# EAGLE design Airquality (EAGLE 9.6.2)
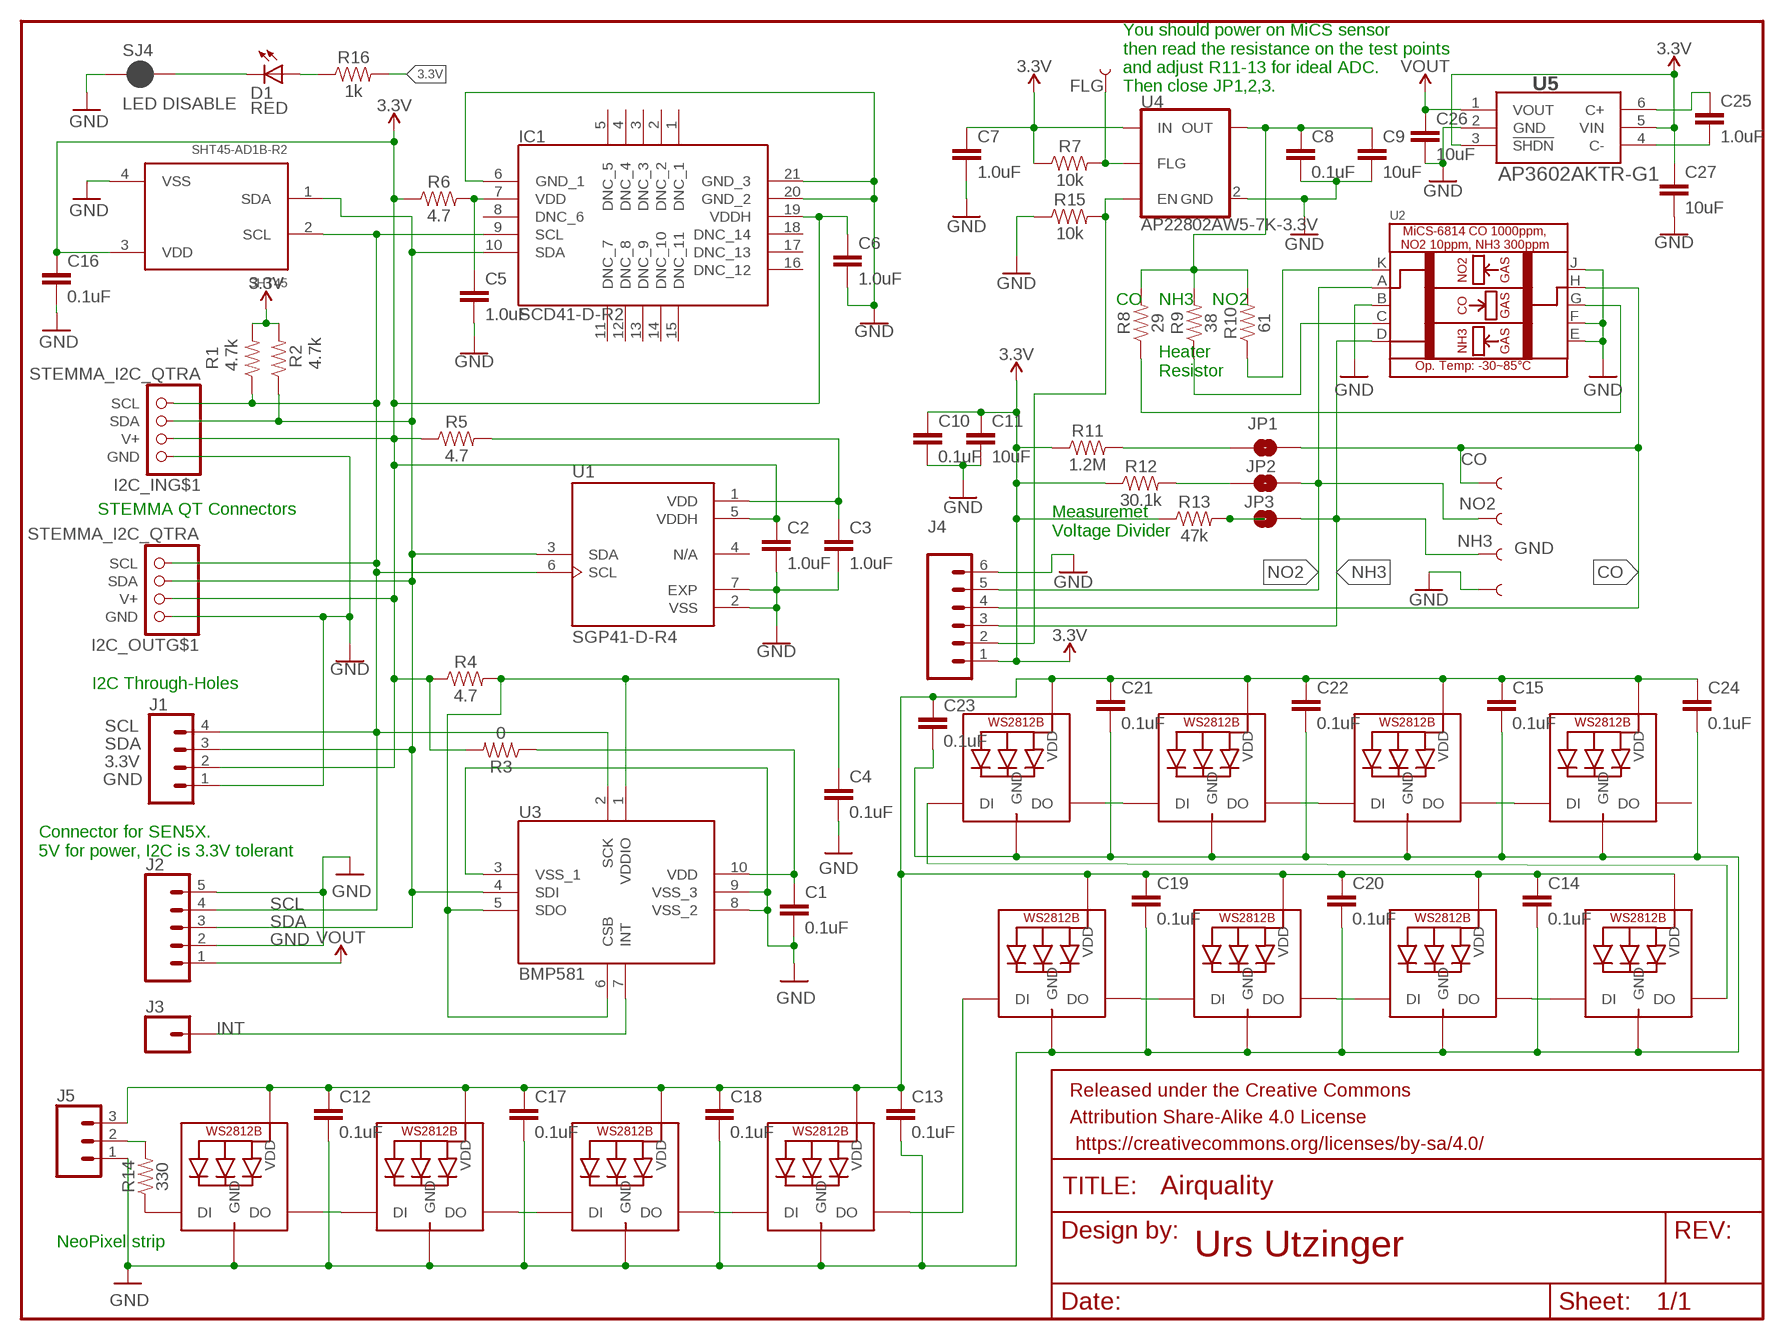
[diagram p0: schematic, sheet 1]

## Parts
C1  0.1uF  0.1UF-0603-25V-(+80/-20%)  [0603]
C2  1.0uF  1.0UF-0603-16V-10%  [0603]
C3  1.0uF  1.0UF-0603-16V-10%  [0603]
C4  0.1uF  0.1UF-0603-25V-(+80/-20%)  [0603]
C5  1.0uF  1.0UF-0603-16V-10%  [0603]
C6  1.0uF  1.0UF-0603-16V-10%  [0603]
C7  1.0uF  1.0UF-0603-16V-10%  [0603]
C8  0.1uF  0.1UF-0603-25V-(+80/-20%)  [0603]
C9  10uF  10UF-0603-6.3V-20%  [0603]
C10  0.1uF  0.1UF-0603-25V-(+80/-20%)  [0603]
C11  10uF  10UF-0603-6.3V-20%  [0603]
C12  0.1uF  0.1UF-0402-16V-10%  [0402]
C13  0.1uF  0.1UF-0402-16V-10%  [0402]
C14  0.1uF  0.1UF-0402-16V-10%  [0402]
C15  0.1uF  0.1UF-0402-16V-10%  [0402]
C16  0.1uF  0.1UF-0603-25V-(+80/-20%)  [0603]
C17  0.1uF  0.1UF-0402-16V-10%  [0402]
C18  0.1uF  0.1UF-0402-16V-10%  [0402]
C19  0.1uF  0.1UF-0402-16V-10%  [0402]
C20  0.1uF  0.1UF-0402-16V-10%  [0402]
C21  0.1uF  0.1UF-0402-16V-10%  [0402]
C22  0.1uF  0.1UF-0402-16V-10%  [0402]
C23  0.1uF  0.1UF-0402-16V-10%  [0402]
C24  0.1uF  0.1UF-0402-16V-10%  [0402]
C25  1.0uF  1.0UF-0402-16V-10%  [0402]
C26  10uF  10UF-0603-6.3V-20%  [0603]
C27  10uF  10UF-0603-6.3V-20%  [0603]
CO  TEST-POINT3X4  [PAD.03X.04]
D1  RED  LED-RED0603  [LED-0603]
FLG  TEST-POINT3X4  [PAD.03X.04]
FRAME1  FRAME-LETTERNO_PACKAGE  [DUMMY]
GND  TEST-POINT3X4  [PAD.03X.04]
I2C_IN  STEMMA_I2C_QTRA  [JST_SH4_RA]
I2C_OUT  STEMMA_I2C_QTRA  [JST_SH4_RA]
IC1  SCD41-D-R2  [SCD41DR2]
J1  CONN_04  [1X04]
J2  CONN_05  [1X05]
J3  CONN_01  [1X01]
J4  CONN_06SILK_FEMALE_PTH  [1X06]
J5  CONN_03  [1X03]
JP1  JUMPER-SMT_2_NO_SILK  [SMT-JUMPER_2_NO_SILK]
JP2  JUMPER-SMT_2_NO_SILK  [SMT-JUMPER_2_NO_SILK]
JP3  JUMPER-SMT_2_NO_SILK  [SMT-JUMPER_2_NO_SILK]
LED0  WS2812B_2020  [WS2812B_2020]
LED1  WS2812B_2020  [WS2812B_2020]
LED2  WS2812B_2020  [WS2812B_2020]
LED3  WS2812B_2020  [WS2812B_2020]
LED4  WS2812B_2020  [WS2812B_2020]
LED5  WS2812B_2020  [WS2812B_2020]
LED6  WS2812B_2020  [WS2812B_2020]
LED7  WS2812B_2020  [WS2812B_2020]
LED8  WS2812B_2020  [WS2812B_2020]
LED9  WS2812B_2020  [WS2812B_2020]
LED10  WS2812B_2020  [WS2812B_2020]
LED11  WS2812B_2020  [WS2812B_2020]
NH3  TEST-POINT3X4  [PAD.03X.04]
NO2  TEST-POINT3X4  [PAD.03X.04]
R1  4.7k  4.7KOHM-0603-1/10W-1%  [0603]
R2  4.7k  4.7KOHM-0603-1/10W-1%  [0603]
R3  0  10OHM-0603-1/10W-5%  [0603]
R4  4.7  10OHM-0603-1/10W-5%  [0603]
R5  4.7  10OHM-0603-1/10W-1%  [0603]
R6  4.7  10OHM-0603-1/10W-1%  [0603]
R7  10k  10KOHM-0603-1/10W-1%  [0603]
R8  29  27OHM-0603-1/10W-1%  [0603]
R9  38  33OHM-0603-1/10W-1%  [0603]
R10  61  82OHM-0603-1/10W-1%  [0603]
R11  1.2M  1.2MOHM-0603-1/10W-1%  [0603]
R12  30.1k  30.1KOHM-0603-1/10W-1%  [0603]
R13  47k  47KOHM-0603-1/10W-1%  [0603]
R14  330  330OHM-0603-1/10W-1%  [0603]
R15  10k  10KOHM-0603-1/10W-1%  [0603]
R16  1k  1KOHM-0603-1/10W-1%  [0603]
SHT45  SHT45-AD1B-R2  [SHT4X]
SJ4  LED DISABLE  JUMPER-SMT_2_NC_PASTE_SILK  [SMT-JUMPER_2_NC_PASTE_SILK]
U1  SGP41-D-R4  [XDCR_SGP41-D-R4]
U2  MICROBUILDER_MICS-5524  [MICROBUILDER_MICS-5524]
U3  BMP581  [BMP581]
U4  AP22802AW5-7K-3.3V  [SOT25]
U5  AP3602AKTR-G1  [SOT95P280X125-6N]

## Nets
3.3V: C2.1 C6.1 C7.1 C10.1 C11.1 C16.1 C27.1 I2C_IN.2(V+) I2C_OUT.2(V+) IC1.19(VDDH) J1.2 J4.1 R1.2 R2.2 R3.2 R4.1 R5.1 R6.1 R7.1 R11.1 R12.1 R13.1 R16.2 SHT45.3(VDD) U1.5(VDDH) U4.5(IN) U5.3(!SHDN) U5.5(VIN)
CO: CO.P$1 J4.4 JP1.2 U2.H
GND: C1.2 C2.2 C3.2 C4.2 C5.2 C6.2 C7.2 C8.2 C9.2 C10.2 C11.2 C12.2 C13.2 C14.2 C15.2 C16.2 C17.2 C18.2 C19.2 C20.2 C21.2 C22.2 C23.2 C24.2 C26.2 C27.2 GND.P$1 I2C_IN.1(GND) I2C_OUT.1(GND) IC1.6(GND_1) IC1.20(GND_2) IC1.21(GND_3) J1.1 J2.2 J2.5 J4.6 J5.1 LED0.2(GND) LED1.2(GND) LED2.2(GND) LED3.2(GND) LED4.2(GND) LED5.2(GND) LED6.2(GND) LED7.2(GND) LED8.2(GND) LED9.2(GND) LED10.2(GND) LED11.2(GND) R15.1 SHT45.4(VSS) SJ4.1 U1.2(VSS) U1.7(EXP) U2.B U2.E U2.F U2.J U3.3(VSS_1) U3.8(VSS_2) U3.9(VSS_3) U4.2(GND) U5.2(GND)
INT: J3.1 U3.7(INT)
N$1: C4.1 R4.2 U3.1(VDDIO) U3.5(SDO) U3.6(CSB)
N$2: C1.1 R3.1 U3.10(VDD)
N$3: FLG.P$1 R7.2 U4.3(FLG)
N$4: C3.1 R5.2 U1.1(VDD)
N$5: C5.1 IC1.7(VDD) R6.2
N$6: LED0.1(DO) LED1.3(DI)
N$7: C8.1 C9.1 R8.2 R9.2 R10.2 U4.1(OUT)
N$8: R10.1 U2.K
N$10: JP1.1 R11.2
N$11: R9.1 U2.C
N$12: JP2.1 R12.2
N$13: R8.1 U2.G
N$14: JP3.1 R13.2
N$15: C25.1 U5.6(C+)
N$16: LED1.1(DO) LED2.3(DI)
N$17: LED2.1(DO) LED3.3(DI)
N$18: LED4.1(DO) LED5.3(DI)
N$19: LED5.1(DO) LED6.3(DI)
N$20: LED6.1(DO) LED7.3(DI)
N$21: LED3.1(DO) LED4.3(DI)
N$22: J5.2 R14.2
N$23: LED0.3(DI) R14.1
N$24: LED7.1(DO) LED8.3(DI)
N$25: LED10.1(DO) LED11.3(DI)
N$26: D1.A R16.1
N$27: LED9.1(DO) LED10.3(DI)
N$28: D1.C SJ4.2
N$29: LED8.1(DO) LED9.3(DI)
N$30: C25.2 U5.4(C-)
N$31: C12.1 C13.1 C14.1 C15.1 C17.1 C18.1 C19.1 C20.1 C21.1 C22.1 C23.1 C24.1 J5.3 LED0.4(VDD) LED1.4(VDD) LED2.4(VDD) LED3.4(VDD) LED4.4(VDD) LED5.4(VDD) LED6.4(VDD) LED7.4(VDD) LED8.4(VDD) LED9.4(VDD) LED10.4(VDD) LED11.4(VDD)
N$32: J4.2 R15.2 U4.4(EN)
NH3: J4.3 JP3.2 NH3.P$1 U2.D
NO2: J4.5 JP2.2 NO2.P$1 U2.A
SCL: I2C_IN.4(SCL) I2C_OUT.4(SCL) IC1.9(SCL) J1.4 J2.4 R1.1 SHT45.2(SCL) U1.6(SCL) U3.2(SCK)
SDA: I2C_IN.3(SDA) I2C_OUT.3(SDA) IC1.10(SDA) J1.3 J2.3 R2.1 SHT45.1(SDA) U1.3(SDA) U3.4(SDI)
VOUT: C26.1 J2.1 U5.1(VOUT)
Unconnected: I2C_IN.MT1(MT) I2C_IN.MT2(MT) I2C_OUT.MT1(MT) I2C_OUT.MT2(MT) IC1.1(DNC_1) IC1.2(DNC_2) IC1.3(DNC_3) IC1.4(DNC_4) IC1.5(DNC_5) IC1.8(DNC_6) IC1.11(DNC_7) IC1.12(DNC_8) IC1.13(DNC_9) IC1.14(DNC_10) IC1.15(DNC_11) IC1.16(DNC_12) IC1.17(DNC_13) IC1.18(DNC_14) LED11.1(DO) U1.4(N/A)

## Notes on the sheet
- You should power on MiCS sensor
  then read the resistance on the test points
  and adjust R11-13 for ideal ADC.
  Then close JP1,2,3.
- CO | NH3 | NO2
- Heater
  Resistor
- STEMMA QT Connectors
- Measuremet
  Voltage Divider
- I2C Through-Holes
- Connector for SEN5X.
  5V for power, I2C is 3.3V tolerant
- NeoPixel strip
- Urs Utzinger

## Library data of the parts
C1 C4 C8 C10 C16 = SparkFun-Capacitors:0.1UF: 0.1µF ceramic capacitors A capacitor is a passive two-terminal electrical component used to store electrical energy temporarily in an electric field.; PROD_ID: CAP-00810
C2 C3 C5-C7 = SparkFun-Capacitors:1.0UF: 1µF ceramic capacitors A capacitor is a passive two-terminal electrical component used to store electrical energy temporarily in an electric field.; PROD_ID: CAP-00868
C9 C11 C26 C27 = SparkFun-Capacitors:10UF: 10.0µF ceramic capacitors A capacitor is a passive two-terminal electrical component used to store electrical energy temporarily in an electric field.; PROD_ID: CAP-11015
C12-C15 C17-C24 = SparkFun-Capacitors:0.1UF: 0.1µF ceramic capacitors A capacitor is a passive two-terminal electrical component used to store electrical energy temporarily in an electric field.; PROD_ID: CAP-12416
C25 = SparkFun-Capacitors:1.0UF: 1µF ceramic capacitors A capacitor is a passive two-terminal electrical component used to store electrical energy temporarily in an electric field.; PROD_ID: CAP-12417
CO FLG GND NH3 NO2 = SparkFun-Connectors:TEST-POINT: SparkFun Test Points Bare copper test points for troubleshooting or In-Circuit-Testing. These are used by our Production team for verifying production board runs using pogo-pins on test beds. SparkFun Products: SparkFun LSM9DS1 Breakout <https://www.sparkfun.com/products/13284> SparkFun PSOC <https://www.sparkfun.com/products/13714> SparkFun Load Cell Amplifier <https://www.sparkfun.com/products/13879>
D1 = SparkFun-LED:LED-RED: Assorted Red LEDs LilyPad 1206- DIO-09912 1206- DIO-00809 0603- DIO-00819; PROD_ID: DIO-00819
FRAME1 = SparkFun-Aesthetics:FRAME-LETTER: Schematic Frame - Letter Standard 8.5x11 US Letter frame; DESIGNER: Nobody; VERSION: v01
I2C_IN I2C_OUT = adafruit_electromech:STEMMA_I2C; LCSC: C145961
IC1 = SCD41-D-R2:SCD41-D-R2: Air Quality Sensor CO2 Sensor 2.5V/3.3V/5V 20-Pin SMD EP Source: Datasheet <https://cz.mouser.com/datasheet/2/682/Sensirion_CO2_Sensors_SCD4x_Datasheet-2010009.pdf>; ARROW_PART_NUMBER: SCD41-D-R2; ARROW_PRICE-STOCK: https://www.arrow.com/en/products/scd41-d-r2/sensirion-ag?region=asia; DESCRIPTION: Air Quality Sensor CO2 Sensor 2.5V/3.3V/5V 20-Pin SMD EP; HEIGHT: 6.8mm; MANUFACTURER_NAME: Sensirion; MANUFACTURER_PART_NUMBER: SCD41-D-R2; MOUSER_PART_NUMBER: 403-SCD41-D-R2; MOUSER_PRICE-STOCK: https://www.mouser.co.uk/ProductDetail/Sensirion/SCD41-D-R2?qs=HBWAp0VN4Ri4o7ei4T3s0g%3D%3D
J1 = SparkFun-Connectors:CONN_04: Multi connection point. Often used as Generic Header-pin footprint for 0.1 inch spaced/style header connections On any of the 0.1 inch spaced packages, you can populate with these: Break Away Headers - Straight <https://www.sparkfun.com/products/116> (PRT-00116) Break Away Male Headers - Right Angle <https://www.sparkfun.com/products/553> (PRT-00553) Female Headers <https://www.sparkfun.com/products/115> (PRT-00115) Break Away Headers - Machine Pin <https://www.sparkfun.com/products/117> (PRT-00117) Break Away Female Headers - Swiss Machine Pin <https://www.sparkfun.com/products/743> (PRT-00743) For SCREWTERMINALS and SPRING TERMINALS visit here: Screw Terimnals on SparkFun.com <https://www.sparkfun.com/search/results?term=Screw+Terminals> (5mm/3.5mm/2.54mm spacing) This device is also useful as a general connection point to wire up your design to another part of your project. Our various solder wires solder well into these plated through hole pads. Hook-Up Wire - Assortment (Stranded, 22 AWG) <https://www.sparkfun.com/products/11375> (PRT-11375) Hook-Up Wire - Assortment (Solid Core, 22 AWG) <https://www.sparkfun.com/products/11367> (PRT-11367) View the entire wire category on our website here <https://www.sparkfun.com/categories/141> Special notes: Molex polarized connector foot print use with SKU : PRT-08231 with associated crimp pins and housings. 1MM SMD Version SKU: PRT-10208; PROD_ID: CONN-09696
J2 = SparkFun-Connectors:CONN_05: Multi connection point. Often used as Generic Header-pin footprint for 0.1 inch spaced/style header connections On any of the 0.1 inch spaced packages, you can populate with these: Break Away Headers - Straight <https://www.sparkfun.com/products/116> (PRT-00116) Break Away Male Headers - Right Angle <https://www.sparkfun.com/products/553> (PRT-00553) Female Headers <https://www.sparkfun.com/products/115> (PRT-00115) Break Away Headers - Machine Pin <https://www.sparkfun.com/products/117> (PRT-00117) Break Away Female Headers - Swiss Machine Pin <https://www.sparkfun.com/products/743> (PRT-00743) For SCREWTERMINALS and SPRING TERMINALS visit here: Screw Terimnals on SparkFun.com <https://www.sparkfun.com/search/results?term=Screw+Terminals> (5mm/3.5mm/2.54mm spacing) This device is also useful as a general connection point to wire up your design to another part of your project. Our various solder wires solder well into these plated through hole pads. Hook-Up Wire - Assortment (Stranded, 22 AWG) <https://www.sparkfun.com/products/11375> (PRT-11375) Hook-Up Wire - Assortment (Solid Core, 22 AWG) <https://www.sparkfun.com/products/11367> (PRT-11367) View the entire wire category on our website here <https://www.sparkfun.com/categories/141> Special notes: Molex polarized connector foot print use with SKU : PRT-08231 with associated crimp pins and housings. 1MM SMD Version SKU: PRT-10208
J3 = SparkFun-Connectors:CONN_01: Single connection point. Often used as Generic Header-pin footprint for 0.1 inch spaced/style header connections On any of the 0.1 inch spaced packages, you can populate with these: Break Away Headers - Straight <https://www.sparkfun.com/products/116> (PRT-00116) Break Away Male Headers - Right Angle <https://www.sparkfun.com/products/553> (PRT-00553) Female Headers <https://www.sparkfun.com/products/115> (PRT-00115) Break Away Headers - Machine Pin <https://www.sparkfun.com/products/117> (PRT-00117) Break Away Female Headers - Swiss Machine Pin <https://www.sparkfun.com/products/743> (PRT-00743) This device is also useful as a general connection point to wire up your design to another part of your project. Our various solder wires solder well into these plated through hole pads. Hook-Up Wire - Assortment (Stranded, 22 AWG) <https://www.sparkfun.com/products/11375> (PRT-11375) Hook-Up Wire - Assortment (Solid Core, 22 AWG) <https://www.sparkfun.com/products/11367> (PRT-11367) View the entire wire category on our website here <https://www.sparkfun.com/categories/141> Special notes: SMTSO-256-ET is a "flush mount" nut for a 4-40 screw. We mostly use this on specialty testbeds; it is a nice way to connect hardware to your PCB at an adjustable hieght. Also note, the SNAP packages are for using a snappable style connector. We sell a baggie of snaps and they are also used on two LilyPad designs: Snap Assortment - 30 pack (male and female) <https://www.sparkfun.com/products/11347> (DEV-11347) LilyPad Arduino SimpleSnap <https://www.sparkfun.com/products/10941> (DEV-10941) LilyPad SimpleSnap Protoboard <https://www.sparkfun.com/products/10940> (DEV-10940)
J4 = SparkFun-Connectors:CONN_06: Multi connection point. Often used as Generic Header-pin footprint for 0.1 inch spaced/style header connections On any of the 0.1 inch spaced packages, you can populate with these: Break Away Headers - Straight <https://www.sparkfun.com/products/116> (PRT-00116) Break Away Male Headers - Right Angle <https://www.sparkfun.com/products/553> (PRT-00553) Female Headers <https://www.sparkfun.com/products/115> (PRT-00115) Break Away Headers - Machine Pin <https://www.sparkfun.com/products/117> (PRT-00117) Break Away Female Headers - Swiss Machine Pin <https://www.sparkfun.com/products/743> (PRT-00743) Arduino Stackable Header - 6 Pin <https://www.sparkfun.com/products/9280> (PRT-09280) For SCREWTERMINALS and SPRING TERMINALS visit here: Screw Terimnals on SparkFun.com <https://www.sparkfun.com/search/results?term=Screw+Terminals> (5mm/3.5mm/2.54mm spacing) This device is also useful as a general connection point to wire up your design to another part of your project. Our various solder wires solder well into these plated through hole pads. Hook-Up Wire - Assortment (Stranded, 22 AWG) <https://www.sparkfun.com/products/11375> (PRT-11375) Hook-Up Wire - Assortment (Solid Core, 22 AWG) <https://www.sparkfun.com/products/11367> (PRT-11367) View the entire wire category on our website here <https://www.sparkfun.com/categories/141>; PROD_ID: CONN-08437
J5 = SparkFun-Connectors:CONN_03: Multi connection point. Often used as Generic Header-pin footprint for 0.1 inch spaced/style header connections On any of the 0.1 inch spaced packages, you can populate with these: Break Away Headers - Straight <https://www.sparkfun.com/products/116> (PRT-00116) Break Away Male Headers - Right Angle <https://www.sparkfun.com/products/553> (PRT-00553) Female Headers <https://www.sparkfun.com/products/115> (PRT-00115) Break Away Headers - Machine Pin <https://www.sparkfun.com/products/117> (PRT-00117) Break Away Female Headers - Swiss Machine Pin <https://www.sparkfun.com/products/743> (PRT-00743) Stackable Header - 3 Pin (Female, 0.1") <https://www.sparkfun.com/products/13875> (PRT-13875) For SCREWTERMINALS and SPRING TERMINALS visit here: Screw Terimnals on SparkFun.com <https://www.sparkfun.com/search/results?term=Screw+Terminals> (5mm/3.5mm/2.54mm spacing) This device is also useful as a general connection point to wire up your design to another part of your project. Our various solder wires solder well into these plated through hole pads. Hook-Up Wire - Assortment (Stranded, 22 AWG) <https://www.sparkfun.com/products/11375> (PRT-11375) Hook-Up Wire - Assortment (Solid Core, 22 AWG) <https://www.sparkfun.com/products/11367> (PRT-11367) View the entire wire category on our website here <https://www.sparkfun.com/categories/141> Special notes: Molex polarized connector foot print use with SKU : PRT-08232 with associated crimp pins and housings.
JP1-JP3 = SparkFun-Jumpers:JUMPER-SMT_2_NO: Normally open jumper This jumper has two pads in close proximity to each other. Apply solder to close the connection. Round pads are easier to solder for beginners, but are a lot larger. SparkFun Product that uses the round pads: SparkFun EL Sequencer <https://www.sparkfun.com/products/12781>
LED0 LED1-LED11 = NEOPixel:WS2812B
R1 R2 = SparkFun-Resistors:4.7KOHM: 4.7kΩ resistor A resistor is a passive two-terminal electrical component that implements electrical resistance as a circuit element. Resistors act to reduce current flow, and, at the same time, act to lower voltage levels within circuits. - Wikipedia; PROD_ID: RES-07857
R3 R4 = SparkFun-Resistors:10OHM: 10Ω resistor A resistor is a passive two-terminal electrical component that implements electrical resistance as a circuit element. Resistors act to reduce current flow, and, at the same time, act to lower voltage levels within circuits. - Wikipedia; PROD_ID: RES-09834; VALUE: 10
R5 R6 = SparkFun-Resistors:10OHM: 10Ω resistor A resistor is a passive two-terminal electrical component that implements electrical resistance as a circuit element. Resistors act to reduce current flow, and, at the same time, act to lower voltage levels within circuits. - Wikipedia; PROD_ID: RES-12581; VALUE: 10
R7 R15 = SparkFun-Resistors:10KOHM: 10kΩ resistor A resistor is a passive two-terminal electrical component that implements electrical resistance as a circuit element. Resistors act to reduce current flow, and, at the same time, act to lower voltage levels within circuits. - Wikipedia; PROD_ID: RES-00824
R8 = SparkFun-Resistors:27OHM: 27Ω resistor A resistor is a passive two-terminal electrical component that implements electrical resistance as a circuit element. Resistors act to reduce current flow, and, at the same time, act to lower voltage levels within circuits. - Wikipedia; PROD_ID: RES-09334; VALUE: 27
R9 = SparkFun-Resistors:33OHM: 33Ω resistor A resistor is a passive two-terminal electrical component that implements electrical resistance as a circuit element. Resistors act to reduce current flow, and, at the same time, act to lower voltage levels within circuits. - Wikipedia; PROD_ID: RES-08270; VALUE: 33
R10 = SparkFun-Resistors:82OHM: 82Ω resistor A resistor is a passive two-terminal electrical component that implements electrical resistance as a circuit element. Resistors act to reduce current flow, and, at the same time, act to lower voltage levels within circuits. - Wikipedia; PROD_ID: RES-12311; VALUE: 82
R11 = SparkFun-Resistors:1.2MOHM: 1.2MΩ resistor A resistor is a passive two-terminal electrical component that implements electrical resistance as a circuit element. Resistors act to reduce current flow, and, at the same time, act to lower voltage levels within circuits. - Wikipedia; PROD_ID: RES-10055
R12 = SparkFun-Resistors:30.1KOHM: 30.1kΩ resistor A resistor is a passive two-terminal electrical component that implements electrical resistance as a circuit element. Resistors act to reduce current flow, and, at the same time, act to lower voltage levels within circuits. - Wikipedia; PROD_ID: RES-08595
R13 = SparkFun-Resistors:47KOHM: 47kΩ resistor A resistor is a passive two-terminal electrical component that implements electrical resistance as a circuit element. Resistors act to reduce current flow, and, at the same time, act to lower voltage levels within circuits. - Wikipedia; PROD_ID: RES-07871
R14 = SparkFun-Resistors:330OHM: 330Ω resistor A resistor is a passive two-terminal electrical component that implements electrical resistance as a circuit element. Resistors act to reduce current flow, and, at the same time, act to lower voltage levels within circuits. - Wikipedia; PROD_ID: RES-00818
R16 = SparkFun-Resistors:1KOHM: 1kΩ resistor A resistor is a passive two-terminal electrical component that implements electrical resistance as a circuit element. Resistors act to reduce current flow, and, at the same time, act to lower voltage levels within circuits. - Wikipedia; PROD_ID: RES-07856
SHT45 = SHT45-AD1B-R2:SHT45-AD1B-R2
SJ4 = SparkFun-Jumpers:JUMPER-SMT_2_NC_PASTE: Normally closed solder jumper This jumper has an aperture in the stencil to allow solder paste to bridge the split in the wire so it's normally closed (NC). Wick off the solder to open the connection. Reapply solder to reclose the connection.
U1 = SGP41-D-R4:SGP41-D-R4; MANUFACTURER: Sensirion; MAXIMUM_PACKAGE_HEIGHT: 0.95 mm; PARTREV: 1.0; STANDARD: Manufacturer Recommendations
U2 = MICS-5524:MICROBUILDER_MICS-5524: MiCS-5524 Carbon Monoxide Gas Sensor Co Detection Range: 1-1000ppm VSupply (Pin F): 4.9-5.1V Operating Temperature: -30~85°C
U3 = BMP581:BMP581: Pressure Sensor 4.35PSI ~ 18.13PSI (30kPa ~ 125kPa) Absolute 10-WFLGA Source: Datasheet <https://www.bosch-sensortec.com/media/boschsensortec/downloads/datasheets/bst-bmp581-ds004.pdf>; DESCRIPTION: Pressure Sensor 4.35PSI ~ 18.13PSI (30kPa ~ 125kPa) Absolute 10-WFLGA; HEIGHT: 0.8mm; MANUFACTURER_NAME: BOSCH; MANUFACTURER_PART_NUMBER: BMP581; MOUSER_PART_NUMBER: 262-BMP581; MOUSER_PRICE-STOCK: https://www.mouser.co.uk/ProductDetail/Bosch-Sensortec/BMP581?qs=Li%252BoUPsLEntPL9tlFmcgXg%3D%3D
U4 = AP22802:AP22802AW5-7: AP22802 SINGLE CHANNEL POWER DISTRIBUTION LOAD SWITCH The AP22802 is a single channel current-limited integrated high-side power switch optimized for Universal Serial Bus (USB) and other hot-swap applications. Mouoser Distributor <https://www.mouser.com/ProductDetail/Diodes-Incorporated/AP22802AW5-7> Features V_in max 5.5V max I_output 2A max V_EN low 0-0.5V V_EN high 1.5 - V_IN Operating Temp -40 - 85C Over Current Protection with Auto Recovery Short Circuit Protection with Auto Recovery Over Temperature Protection with Auto Recovery SOT25 – Footprint of just 9mm2; PROD_ID: VREG-17101
U5 = AP3602AKTR-G1:AP3602AKTR-G1: Switching Voltage Regulators LED Backlight Source: Datasheet <https://www.diodes.com//assets/Datasheets/AP3602A.pdf>; DESCRIPTION: Switching Voltage Regulators LED Backlight; HEIGHT: 1.25mm; MANUFACTURER_NAME: Diodes Incorporated; MANUFACTURER_PART_NUMBER: AP3602AKTR-G1; MOUSER_PART_NUMBER: 621-AP3602AKTR-G1; MOUSER_PRICE-STOCK: https://www.mouser.co.uk/ProductDetail/Diodes-Incorporated/AP3602AKTR-G1?qs=5V6w%252Be2aIqZe7SZnxovZqw%3D%3D

## Board
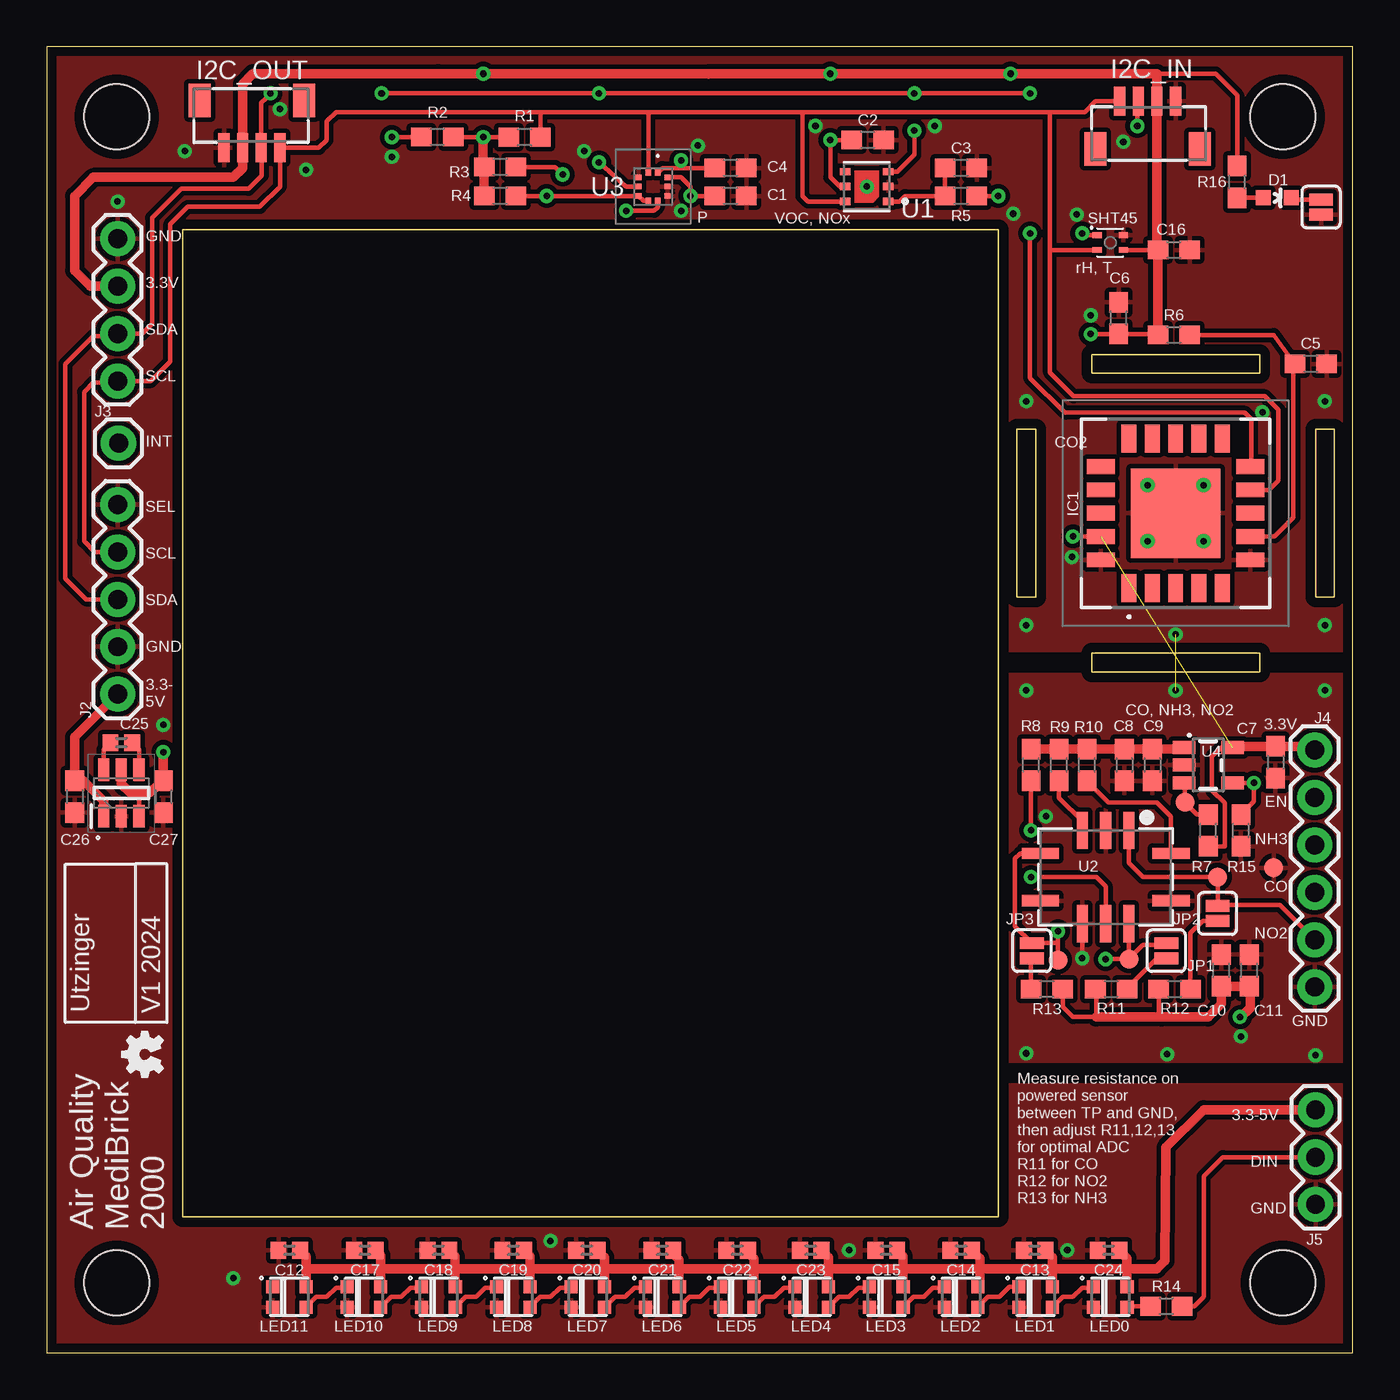
[diagram p1: board, top side]
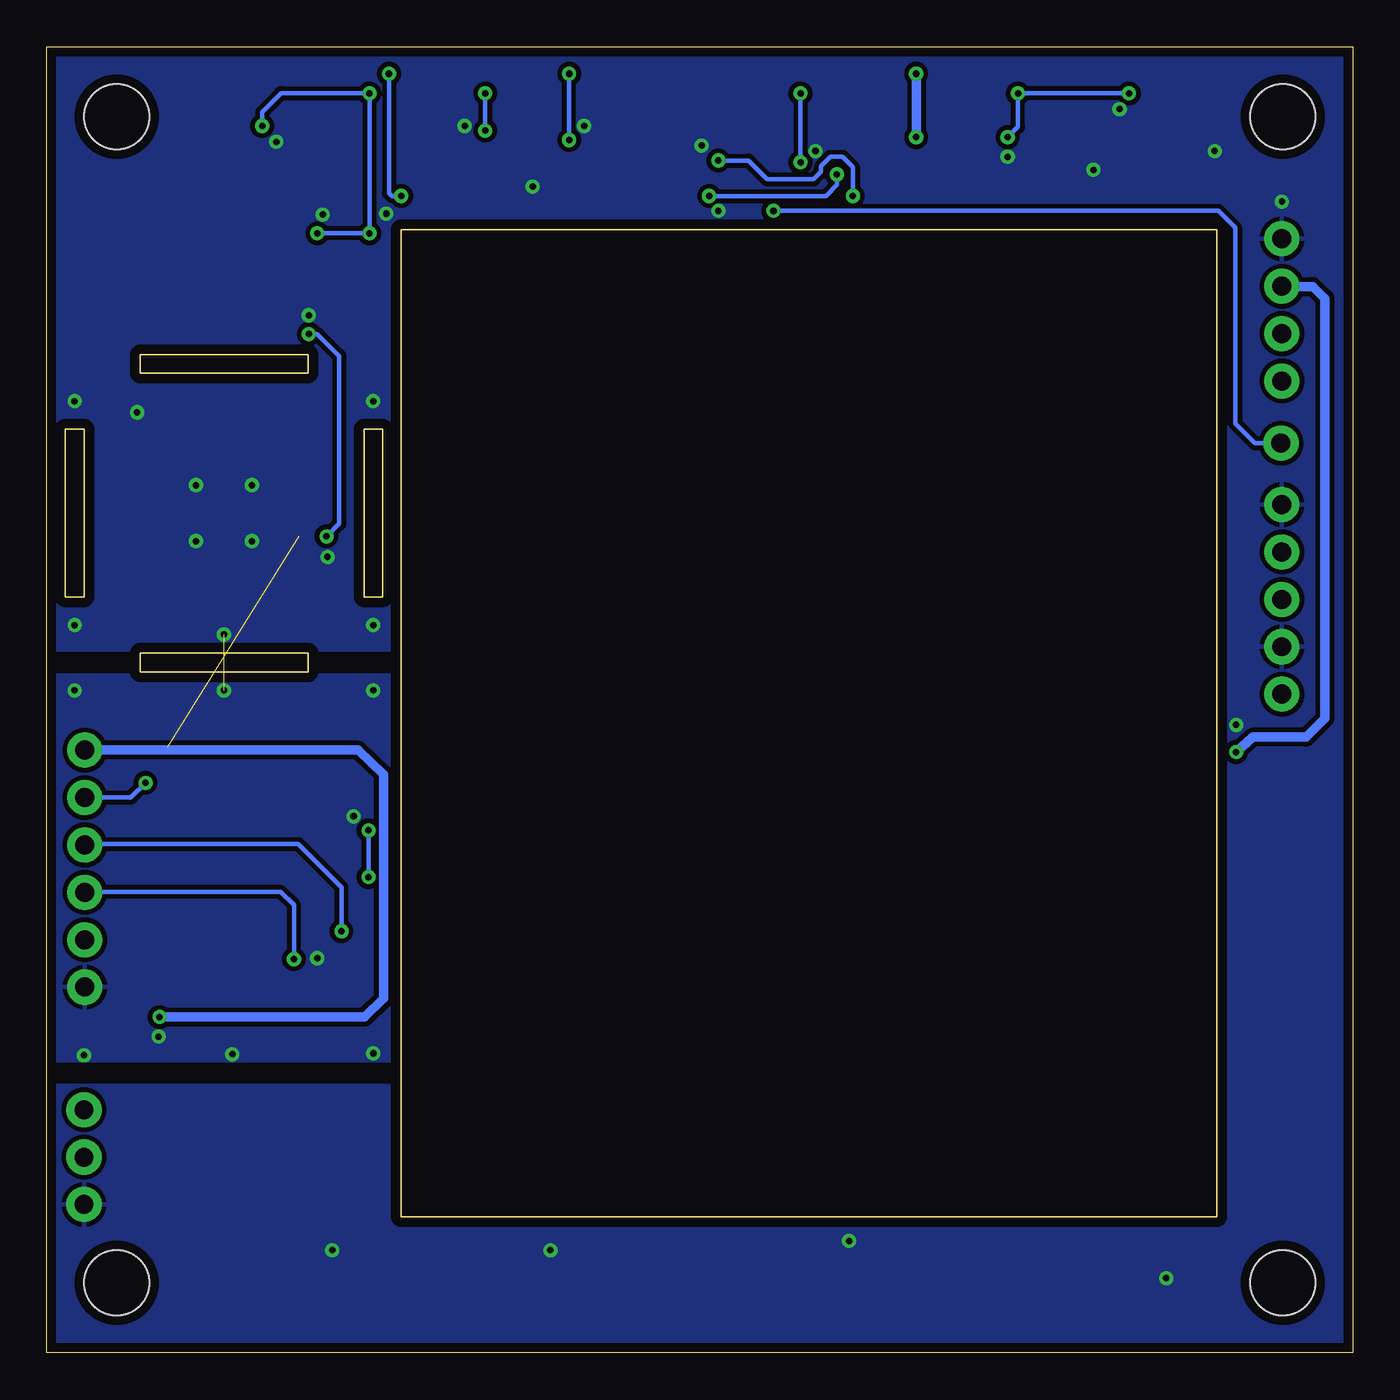
[diagram p2: board, bottom side, seen from below]

Size 70 x 70 mm. Coordinates in mm from the lower left corner, seen from the top.
Outline: 0,0 70,0 70,70 0,70 0,0
Outline: 52,49.5 52,40.5 53,40.5 53,49.5 52,49.5
Outline: 68,49.5 68,40.5 69,40.5 69,49.5 68,49.5
Outline: 56,52.5 65,52.5 65,53.5 56,53.5 56,52.5
Outline: 56,36.5 65,36.5 65,37.5 56,37.5 56,36.5
Outline: 7.3,60.2 51,60.2 51,7.3 7.3,7.3 7.3,60.2
Copper layers (1*16): Top 0.035mm / dielectric 1.5mm / Bottom 0.035mm
Design rules "default *": minimum track width 6mil, minimum drill 0.35mm, track to track 6mil, track to pad 6mil, pad to pad 6mil, via to via 6mil, smd to smd 6mil, copper to edge 20mil, drill to drill 6mil, minimum pad ring 10mil, minimum via ring 8mil, stop-mask expansion 4mil, vias tented up to drill 15mil, thermal gap 10mil
Holes 3.5 mm at 3.75,66.25 66.25,66.25 3.75,3.75 66.25,3.75

### Footprints (pad centres in the part's own frame; a part is rotated, then mirrored left to right if it is on the bottom)
0603 = smd 1.1 x 1: 1 -0.85,0; 2 0.85,0
0402 = smd 0.85 x 0.9: 1 -0.58,0; 2 0.58,0
PAD.03X.04 = smd 1.016 x 1.016: P$1 0,0
LED-0603 = smd 0.8 x 0.8: A 0,-0.75; C 0,0.75
JST_SH4_RA = smd 0.6 x 1.55: 1 1.5,0.924; 2 0.5,0.924; 3 -0.5,0.924; 4 -1.5,0.924 | smd 1.2 x 1.8: MT1 -2.8,-1.624; MT2 2.8,-1.624
SCD41DR2 = smd 1.5 x 0.8: 1 -4,2.5; 2 -4,1.25; 3 -4,0; 4 -4,-1.25; 5 -4,-2.5; 11 4,-2.5; 12 4,-1.25; 13 4,0; 14 4,1.25; 15 4,2.5 | smd 0.8 x 1.5: 6 -2.5,-4; 7 -1.25,-4; 8 0,-4; 9 1.25,-4; 10 2.5,-4; 16 2.5,4; 17 1.25,4; 18 0,4; 19 -1.25,4; 20 -2.5,4 | smd 4.8 x 4.8: 21 0,0
1X04 = drill 1.016 pad 1.88: 1 0,0; 2 2.54,0; 3 5.08,0; 4 7.62,0
1X05 = drill 1.016 pad 1.88: 1 0,0; 2 2.54,0; 3 5.08,0; 4 7.62,0; 5 10.16,0
1X01 = drill 1.016 pad 1.88: 1 0,0
1X06 = drill 1.016 pad 1.88: 1 0,0; 2 2.54,0; 3 5.08,0; 4 7.62,0; 5 10.16,0; 6 12.7,0
1X03 = drill 1.016 pad 1.88: 1 0,0; 2 2.54,0; 3 5.08,0
SMT-JUMPER_2_NO_SILK = smd 0.635 x 1.27: 1 -0.406,0; 2 0.406,0
WS2812B_2020 = smd 0.7 x 0.7: 1 0.9,-0.55; 2 0.9,0.55; 3 -0.9,0.55; 4 -0.9,-0.55
SHT4X = smd 0.5 x 0.3: 1 -0.7,0.4; 2 -0.7,-0.4; 3 0.7,-0.4; 4 0.7,0.4
SMT-JUMPER_2_NC_PASTE_SILK = smd 0.635 x 1.27: 1 -0.406,0; 2 0.406,0
XDCR_SGP41-D-R4 = smd 0.55 x 0.4: 1 -1.15,0.8; 2 -1.15,0; 3 -1.15,-0.8; 4 1.15,-0.8; 5 1.15,0; 6 1.15,0.8 | smd 0.5 x 0.5: 7 0,0
MICROBUILDER_MICS-5524 = smd 0.6 x 2: A 1.25,2.5; B 0,2.5; C -1.25,2.5; F -1.25,-2.5; G 0,-2.5; H 1.25,-2.5 | smd 2 x 0.6: D -3.5,1.27; E -3.5,-1.27; J 3.5,-1.27; K 3.5,1.27
BMP581 = smd 0.325 x 0.3: 1 -0.75,0.25; 2 -0.75,-0.25; 6 0.75,-0.25; 7 0.75,0.25 | smd 0.3 x 0.325: 3 -0.5,-0.775; 4 0,-0.775; 5 0.5,-0.775; 8 0.5,0.775; 9 0,0.775; 10 -0.5,0.775
SOT25 = smd 0.7 x 1.2: 1 -0.95,-1.3; 2 0,-1.3; 3 0.95,-1.3; 4 0.95,1.3; 5 -0.95,1.3
SOT95P280X125-6N = smd 1.2 x 0.6: 1 -1.25,0.95; 2 -1.25,0; 3 -1.25,-0.95; 4 1.25,-0.95; 5 1.25,0; 6 1.25,0.95

### Placement (x,y rotation side)
C1  36.65,62 0 top
C2  44,65 0 top
C3  49,63.5 0 top
C4  36.65,63.5 0 top
C5  67.75,53 0 top
C6  57.45,55.45 90 top
C7  65.85,31.65 270 top
C8  57.75,31.5 270 top
C9  59.25,31.5 270 top
C10  62.95,20.5 90 top
C11  64.45,20.5 90 top
C12  13,5.5 180 top
C13  52.95,5.5 180 top
C14  49,5.5 180 top
C15  45,5.5 180 top
C16  60.4,59.1 0 top
C17  17.05,5.5 180 top
C18  21,5.5 180 top
C19  25,5.5 180 top
C20  28.95,5.5 180 top
C21  33,5.5 180 top
C22  37,5.5 180 top
C23  40.95,5.5 180 top
C24  56.9,5.5 180 top
C25  4,32.7 0 top
C26  1.5,29.8 270 top
C27  6.25,29.8 270 top
CO  58,21.1 0 top
D1  65.95,61.9 270 top
FLG  61,29.5 0 top
FRAME1  0,0 0 top
GND  65.75,26 0 top
I2C_IN  59,66.15 0 top
I2C_OUT  11,65.5 180 top
IC1  60.5,45 90 top
J1  3.8,59.7 270 top
J2  3.8,35.3 90 top
J3  3.85,48.75 0 top
J4  67.95,32.3 270 top
J5  68,7.95 90 top
JP1  60,21.55 90 top
JP2  62.75,23.55 90 top
JP3  52.8,21.55 90 top
LED0  57,3 180 top
LED1  53,3 180 top
LED2  49,3 180 top
LED3  45,3 180 top
LED4  41,3 180 top
LED5  37,3 180 top
LED6  33,3 180 top
LED7  29,3 180 top
LED8  25,3 180 top
LED9  21,3 180 top
LED10  17,3 180 top
LED11  13,3 180 top
NH3  54.2,21.05 0 top
NO2  62.75,25.5 0 top
R1  25.61,65.15 180 top
R2  20.94,65.16 0 top
R3  24.3,63.55 180 top
R4  24.3,62 0 top
R5  49,62 180 top
R6  60.4,54.55 0 top
R7  62.25,28 90 top
R8  52.75,31.5 90 top
R9  54.25,31.5 90 top
R10  55.75,31.5 90 top
R11  57.05,19.5 0 top
R12  60.45,19.5 0 top
R13  53.6,19.5 180 top
R14  60,2.5 0 top
R15  64,28 90 top
R16  63.8,62.75 90 top
SHT45  57,59.5 0 top
SJ4  68.3,61.4 90 top
U1  43.95,62.5 180 top
U2  56.75,25.5 0 top
U3  32.5,62.5 270 top
U4  62.25,31.5 270 top
U5  4,30 90 top
U$2  [OSHW-LOGO-MINI]  5.25,16 90 top

### Tracks (layer width: path | path; a pad name or v marks a point on that pad's centre or on a via)
3.3V  (via drill 0.35)  (1 unrouted)
  Top 0.152: R11.1 56.25,19.45 | 59.45,59.05 59.5,59.1
  Top 0.254: 35.46,68.51 35.5,68.55 | R16.2 63.81,67.39 62.65,68.55 59.5,68.55 | 59.5,67.95 I2C_IN.2 59.45,67.02 | U1.5 42.5,62.5 42,63 v42,65 C2.1 | R5.1 v51,62 | R1.2 v23.4,65.15 v23.39,65.16 R2.2 | R12.1 59.6,18.15 59.75,18 | IC1.19 v55,43.75 54.95,43.75 | v55.95,54.6 C6.1 59.4,54.6 R6.1 | 56.25,19.45 56.25,18 55,18 54.45,18.55 R13.1 | SHT45.3 59.5,59.1 C16.1 | U4.5 62.95,32.45 62.45,31.95 62.45,30.15 63.13,29.47 63.13,27.15 R7.1 | U5.3 4.95,29.95 5,30
  Top 0.508: 35.47,68.55 v23.4,68.55 20.99,68.55 11.05,68.55 10.5,68 I2C_OUT.2 10.5,63.5 10,63 2.5,63 1.5,62 1.5,58 2.34,57.16 J1.2 | 35.47,68.55 35.5,68.55 v42,68.55 v51.65,68.55 59.5,68.55 I2C_IN.2 59.5,59.1 | R4.1 R3.2 23.4,63.6 v23.4,65.15 | C11.1 C10.1 62.95,18.7 62.25,18 59.75,18 56.25,18 | C11.1 64.6,19.65 | 35.47,68.55 35.46,68.51 | U4.5 63.6,32.5 C7.1 67.75,32.5 J4.1 | C11.1 64.5,19.6 64.5,18.5 64,18 v63.95,18 | U5.5 4,30.5 4.5,30 5,30 5.5,30 C27.1 v6.25,32.2 | R6.1 C16.1
  Bottom 0.254: v51.65,68.55 51.65,62.15 51.5,62 v51,62 | v55,43.75 54.32,44.43 54.32,53.42 55.5,54.6 v55.95,54.6 | v42,65 v42,68.55
  Bottom 0.508: v23.4,68.55 v23.4,65.15 | J4.1 53.3,32.3 51.95,31 51.95,28.36 51.95,28.32 51.95,19 52.97,18 v63.95,18 | J1.2 2.15,57.15 1.5,56.5 1.5,34 2.5,33 5.35,33 v6.25,32.2
CO  (via drill 0.35)
  Top 0.254: JP1.2 59.89,21.85 58.75,21.85 CO.P$1 | v56.75,21.1 CO.P$1 | CO.P$1 58,21.95 U2.H
  Bottom 0.254: J4.4 67.93,24.7 57.45,24.7 56.75,24 v56.75,21.1
GND  (via drill 0.35)  (1 unrouted)
  Top 0.254: U2.F v55.5,21.15
  other vias: 59,46.5 59,43.5 62,43.5 62,46.5 65.15,50.4 12.5,66.65 34.9,64.7 13.9,63.4 3.8,61.7 7.4,64.4 28.8,64.4 47.6,65.75 57.7,64.9 53.55,28.75 10,4 27,6 43,5.5 54.7,5.5 52.5,16.05 68,15.95 60.05,16 60.5,35.5 52.5,35.5 68.5,39 52.5,39 52.5,51 68.5,51 43.95,62.5 68.5,35.5 60.5,38.5 18.5,64.1 34,61.2 41.2,65.75 51.8,61.05 55.2,61 55.95,55.6 54.95,42.65 64,16.95 6.25,33.65
  pour Bottom (isolate 0.254): 0,70 0,0 70,0 70,70
  pour Top (isolate 0.254): 0,70 0,0 70,0 70,70
  cutout Top: 51,37.5 70,37.5 70,36.5 51,36.5
  cutout Bottom: 51,37.5 70,37.5 70,36.5 51,36.5
  cutout Bottom: 51,15.5 70,15.5 70,14.5 51,14.5
  cutout Top: 51,15.5 70,15.5 70,14.5 51,14.5
INT  (via drill 0.35)
  Top 0.254: U3.7 32.75,61.4 32.55,61.2 v31.05,61.2
  Bottom 0.254: J3.1 5.25,48.75 6.3,49.8 6.3,60.3 7.2,61.2 v31.05,61.2
N$1  (via drill 0.35)
  Top 0.254: U3.1 33,63.5 34,63.5 | 34,63.5 C4.1 | U3.6 31.98,61.75 U3.5 v26.8,62 R4.2 | v34,63.9 34,63.5
  Bottom 0.254: v34,63.9 32.4,63.9 31.39,62.89 28.9,62.89 28.5,63.29 28.5,63.6 28,64.1 27.35,64.1 26.8,63.55 v26.8,62
N$2  (via drill 0.35)
  Top 0.254: U3.10 34,63 34.5,62.5 v34.5,62 C1.1 | v27.65,63.15 27.25,63.55 R3.1
  Bottom 0.254: v34.5,62 28.25,62 27.65,62.6 v27.65,63.15
N$3
  Top 0.254: U4.3 61,30.5 FLG.P$1 61.65,28.85 R7.2
N$4
  Top 0.254: U1.1 45.7,61.7 46,62 R5.2 C3.1
N$5
  Top 0.254: IC1.7 65.8,43.75 66.81,44.77 66.81,52.86 66.9,52.89 C5.1 65.75,54.55 R6.2
N$6
  Top 0.254: LED0.1 56.05,3.5 55.5,3.5 55,3 54.45,3 LED1.3
N$7
  Top 0.508: R8.2 R9.2 R10.2 C8.1 C9.1 60.85,32.35 U4.1
N$8
  Top 0.254: R10.1 56.9,29.5 59.5,29.5 60.25,28.75 U2.K
N$10
  Top 0.254: R11.2 57.9,19.54 59.5,21.14 JP1.1
N$11
  Top 0.254: R9.1 54.25,29.75 55.5,28.5 U2.C
N$12
  Top 0.254: JP2.1 61.95,23.15 61.3,22.5 R12.2
N$13  (via drill 0.35)
  Top 0.254: v52.75,28 R8.1 | v52.75,25.5 56.25,25.5 56.75,25 U2.G
  Bottom 0.254: v52.75,25.5 v52.75,28
N$14
  Top 0.254: JP3.1 52.75,20.99 R13.2
N$15
  Top 0.254: U5.6 3.05,32.33 C25.1
N$16
  Top 0.254: LED1.1 51.6,3.55 51.05,3 50.45,3 LED2.3
N$17
  Top 0.254: LED2.1 48.05,3.5 47.5,3.5 47,3 46.45,3 LED3.3
N$18
  Top 0.254: LED4.1 40.05,3.5 39.5,3.5 39,3 38.45,3 LED5.3
N$19
  Top 0.254: LED5.1 36.05,3.5 35.5,3.5 35,3 34.45,3 LED6.3
N$20
  Top 0.254: LED6.1 32.05,3.5 31.5,3.5 31,3 30.45,3 LED7.3
N$21
  Top 0.254: LED3.1 44.05,3.5 43.5,3.5 43,3 42.45,3 LED4.3
N$22
  Top 0.254: R14.2 61.5,2.5 62,3 62,9.45 63.04,10.49 J5.2
N$23
  Top 0.254: LED0.3 57.95,2.5 R14.1
N$24
  Top 0.254: LED7.1 28.05,3.5 27.5,3.5 27,3 26.45,3 LED8.3
N$25
  Top 0.254: LED10.1 16.05,3.5 15.5,3.5 15,3 14.45,3 LED11.3
N$26
  Top 0.254: D1.A R16.1
N$27
  Top 0.254: LED9.1 20.05,3.5 19.5,3.5 19,3 18.45,3 LED10.3
N$28
  Top 0.254: SJ4.2 66.79,61.81 D1.C
N$29
  Top 0.254: LED8.1 24.05,3.5 23.5,3.5 23,3 22.45,3 LED9.3
N$30
  Top 0.254: U5.4 4.95,32.33 C25.2
N$31
  Top 0.508: LED3.4 45.9,4.4 | 45.9,4.4 46,4.5 | 50,4.5 46,4.5 | 50,4.5 50,3.65 LED2.4 | 50,4.5 53.85,4.5 | LED1.4 53.9,4.45 | 53.9,4.45 53.85,4.5 | J5.3 62,13.03 59.98,11.01 59.93,4.93 59.5,4.5 58,4.5 | 46,4.5 42,4.5 | 42,4.5 41.9,4.5 | 41.9,4.5 38,4.5 | 38,4.5 34,4.5 | 34,4.5 33.9,4.5 | 33.9,4.5 30,4.5 | LED7.4 29.9,4.4 | 29.9,4.4 30,4.5 | LED6.4 33.9,4.4 34,4.5 | LED5.4 37.9,4.4 | 37.9,4.4 38,4.5 | LED4.4 41.9,4.4 42,4.5 | 13.9,4.5 LED11.4 | 30,4.5 26,4.5 | 26,4.5 22,4.5 | 22,4.5 21.9,4.5 | 21.9,4.5 18,4.5 | 18,4.5 13.9,4.5 | LED8.4 25.9,4.4 | 25.9,4.4 26,4.5 | LED9.4 21.9,4.4 22,4.5 | LED10.4 17.9,4.4 18,4.5 | 53.85,4.5 58,4.5 | LED0.4 57.9,4.4 | 57.9,4.4 58,4.5 | C13.1 53.9,5.13 53.9,4.45 | C14.1 50,5.08 50,4.5 | C23.1 41.9,5.13 41.9,4.5 | C22.1 37.58,5.37 37.9,5.05 37.9,4.4 | C21.1 33.58,5.32 33.9,5 33.9,4.5 | C19.1 25.9,5.18 25.9,4.4 | C18.1 21.9,5.18 21.9,4.5 | C17.1 17.9,5.23 17.9,4.6 18,4.5 | C12.1 13.9,5.18 13.9,4.5 | C15.1 45.9,5.18 45.9,4.4 | C24.1 57.9,5.08 57.9,4.4 | C20.1 29.9,5.13 29.9,4.4
N$32  (via drill 0.35)
  Top 0.254: U4.4 v64.7,30.55 64.7,29.55 R15.2
  Bottom 0.254: v64.7,30.55 65.49,29.76 J4.2
NH3  (via drill 0.35)
  Top 0.254: U2.D 52.17,26.77 51.9,26.5 51.9,22.86 JP3.2 54.2,21.96 NH3.P$1 v54.2,22.6
  Bottom 0.254: v54.2,22.6 54.2,24.95 56.51,27.26 67.91,27.26 J4.3
NO2
  Top 0.254: U2.A 58,26.25 58.75,25.5 NO2.P$1 JP2.2 62.79,24 66.09,24 J4.5
SCL
  Top 0.254: IC1.9 65.5,46.25 66.01,46.76 66.01,50.55 65.28,51.27 55.03,51.27 53.77,52.53 53.77,59.1 | 53.77,59.1 53.77,66.5 | 26.46,66.5 15.5,66.5 15,66 15,65 14.58,64.58 I2C_OUT.4 12.5,62.5 11.42,61.42 7.57,61.42 6.63,60.48 6.63,53.13 5.58,52.08 J1.4 3.72,52 2.5,52 2,51.5 2,43.5 2.58,42.92 J2.4 | 26.46,66.5 32.25,66.5 | U3.2 32.25,66.5 | 32.25,66.5 40.5,66.5 | 40.5,66.5 53.77,66.5 | 40.5,66.5 40.5,62 40.8,61.7 U1.6 | I2C_IN.4 56.21,67.07 55.63,66.5 53.77,66.5 | R1.1 26.46,66.5 | SHT45.2 53.77,59.1
SDA  (via drill 0.35)
  Top 0.254: v52.7,67.5 v46.5,67.5 v29.6,67.5 v17.95,67.5 | IC1.10 64.55,47.5 64.55,50.05 64.22,50.38 54.57,50.38 52.7,52.25 v52.7,60 | v29.6,63.8 31.05,62.5 U3.4 | U1.3 45.6,63.3 46.5,64.2 v46.5,65.5 | v12,67.5 12,67.44 11.5,67 I2C_OUT.3 11.53,64.55 11.53,63.09 10.82,62.38 7.2,62.38 5.65,60.83 5.65,55.15 5.12,54.62 J1.3 3.68,54.5 2.5,54.5 1,53 1,41.5 2.12,40.38 J2.3 | v58.45,65.75 58.45,67.02 I2C_IN.3 | v18.5,65.15 R2.1 | SHT45.1 55.6,59.9 v55.5,60
  Bottom 0.254: v29.6,67.5 v29.6,63.8 | v46.5,67.5 v46.5,65.5 | v12,67.5 v17.95,67.5 17.95,65.7 v18.5,65.15 | v58.45,65.75 58.45,66.5 57.44,67.51 52.71,67.51 v52.7,67.5 v52.7,60 v55.5,60
VOUT
  Top 0.508: U5.1 3.06,28.72 3.06,29.57 1.98,30.65 C26.1 1.5,33 J2.1

### Text on the board
tNames: P | GND | VOC, NOx | rH, T | 3.3V | SDA | SCL | INT | CO2 | SEL | SCL | SDA | GND | 3.3- / 5V | CO, NH3, NO2 | 3.3V | EN | NH3 | CO | NO2 | Utzinger | V1 2024 | GND | 3.3-5V | DIN | Measure resistance on / powered sensor / between TP and GND, / then adjust R11,12,13 / for optimal ADC / R11 for CO / R12 for NO2 / R13 for NH3 | Air Quality / MediBrick / 2000 | GND